# EAGLE design Timer (EAGLE 6.3)
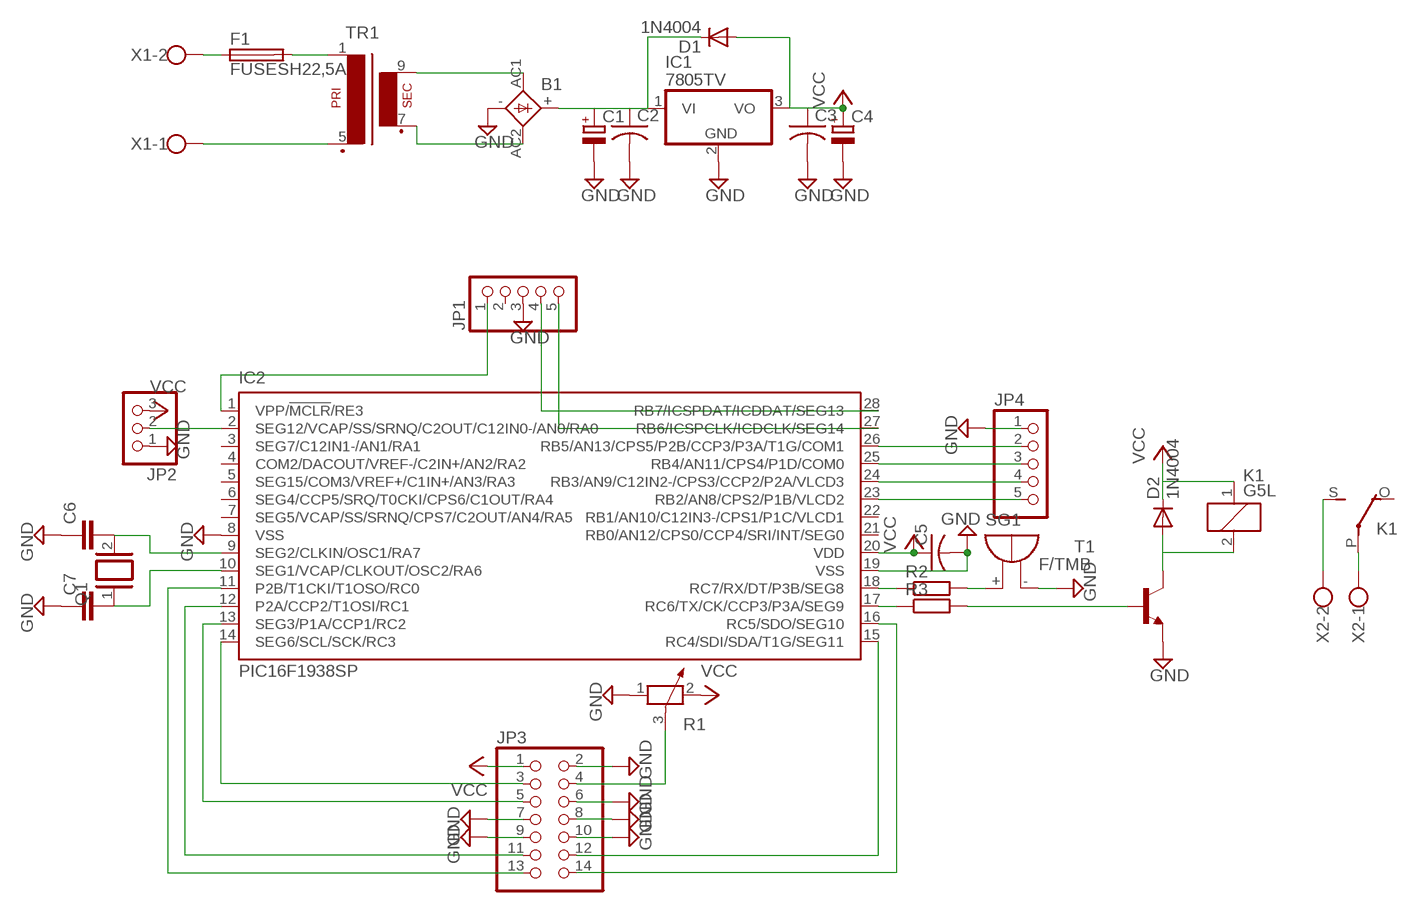
[diagram p0: schematic, sheet 1]

## Parts
B1  1KAB  [1KAB]
C1  CPOL-EUE5-13  [E5-13]
C2  C-US050-030X075  [C050-030X075]
C3  C-US050-030X075  [C050-030X075]
C4  CPOL-EUE3.5-8  [E3,5-8]
C5  C-US050-030X075  [C050-030X075]
C6  C2,5-3  [C2.5-3]
C7  C2,5-3  [C2.5-3]
D1  1N4004  [DO41-10]
D2  1N4004  [DO41-10]
F1  FUSESH22,5A  [SH22,5A]
IC1  7805TV  [TO220V]
IC2  PIC16F1938SP  [DIL28-3]
JP1  PINHD-1X5  [1X05]
JP2  PINHD-1X3  [1X03]
JP3  PINHD-2X7  [2X07]
JP4  PINHD-1X5  [1X05]
K1  G5L  [G5LE]
Q1  XTAL/S  [QS]
R1  POTENTIOMETER_PT-10  [PT-10]
R2  R-EU_0207/10  [0207/10]
R3  R-EU_0207/10  [0207/10]
SG1  F/TMB  [F/TMB]
T1  BC547-NPN-TO92-CBE  [TO92-CBE]
TR1  VV11  [VV11]
X1  W237-102  [W237-102]
X2  W237-102  [W237-102]

## Nets
GND: B1.- C1.- C2.2 C3.2 C4.- C5.2 C6.1 C7.1 IC1.2(GND) IC2.8(VSS) IC2.19(VSS) JP1.3 JP2.1 JP3.2 JP3.6 JP3.7 JP3.8 JP3.9 JP3.10 JP4.1 R1.1 SG1.- T1.E
N$1: JP3.4 R1.3
N$2: F1.1 X1.2
N$3: F1.2 TR1.1
N$4: TR1.5(P2) X1.1
N$5: B1.AC1 TR1.9(S4)
N$6: B1.AC2 TR1.7(S3)
N$7: B1.+ C1.+ C2.1 D1.C IC1.1(VI)
N$8: IC2.1(VPP/!MCLR!/RE3) JP1.1
N$9: IC2.28(RB7/ICSPDAT/ICDDAT/SEG13) JP1.4
N$10: IC2.27(RB6/ICSPCLK/ICDCLK/SEG14) JP1.5
N$11: IC2.2(SEG12/VCAP/SS/SRNQ/C2OUT/C12IN0-/AN0/RA0) JP2.2
N$12: IC2.14(SEG6/SCL/SCK/RC3) JP3.3
N$13: C6.2 IC2.9(SEG2/CLKIN/OSC1/RA7) Q1.2
N$14: C7.2 IC2.10(SEG1/VCAP/CLKOUT/OSC2/RA6) Q1.1
N$15: IC2.13(SEG3/P1A/CCP1/RC2) JP3.5
N$16: IC2.12(P2A/CCP2/T1OSI/RC1) JP3.11
N$17: IC2.11(P2B/T1CKI/T1OSO/RC0) JP3.13
N$18: IC2.15(RC4/SDI/SDA/T1G/SEG11) JP3.12
N$19: IC2.16(RC5/SDO/SEG10) JP3.14
N$20: IC2.26(RB5/AN13/CPS5/P2B/CCP3/P3A/T1G/COM1) JP4.2
N$21: IC2.25(RB4/AN11/CPS4/P1D/COM0) JP4.3
N$22: IC2.24(RB3/AN9/C12IN2-/CPS3/CCP2/P2A/VLCD3) JP4.4
N$23: IC2.23(RB2/AN8/CPS2/P1B/VLCD2) JP4.5
N$24: IC2.18(RC7/RX/DT/P3B/SEG8) R2.1
N$25: R2.2 SG1.+
N$26: IC2.17(RC6/TX/CK/CCP3/P3A/SEG9) R3.1
N$27: R3.2 T1.B
N$28: D2.A K1.2 T1.C
N$29: K1.P(2:P) X2.1
N$30: K1.S(2:S) X2.2
VCC: C3.1 C4.+ C5.1 D1.A D2.C IC1.3(VO) IC2.20(VDD) JP2.3 JP3.1 K1.1 R1.2
Unconnected: IC2.3(SEG7/C12IN1-/AN1/RA1) IC2.4(COM2/DACOUT/VREF-/C2IN+/AN2/RA2) IC2.5(SEG15/COM3/VREF+/C1IN+/AN3/RA3) IC2.6(SEG4/CCP5/SRQ/T0CKI/CPS6/C1OUT/RA4) IC2.7(SEG5/VCAP/SS/SRNQ/CPS7/C2OUT/AN4/RA5) IC2.21(RB0/AN12/CPS0/CCP4/SRI/INT/SEG0) IC2.22(RB1/AN10/C12IN3-/CPS1/P1C/VLCD1) JP1.2 K1.O(2:O)

## Library data of the parts
B1 = rectifier:1KAB: RECTIFIER grid 5,08 x 5,08 mm
C1 = resistor:CPOL-EU: POLARIZED CAPACITOR, European symbol
C2 C3 C5 = rcl:C-US: CAPACITOR, American symbol
C4 = rcl:CPOL-EU: POLARIZED CAPACITOR, European symbol
C6 C7 = capacitor-wima:C: CAPACITOR naming: grid - package width
D1 D2 = diode:1N4004: DIODE general purpose rectifier, 1 A
F1 = fuse:FUSE: Fuse; OC_FARNELL: unknown; OC_NEWARK: unknown
IC1 = linear:78*: Positive VOLTAGE REGULATOR Source: http://cache.national.com/ds/LM/LM78L05.pdf http://www.fairchildsemi.com/ds/LM/LM7805.pdf
IC2 = microchip:PIC16F19*: Flash-Based, 8-Bit CMOS Microcontrollers wtih LCD Driver and nanoWatt XLP Technology Auto generated by make-symbol-device-package-bsdl.ulp Rev. 33 Source: http://ww1.microchip.com/downloads/en/DeviceDoc/41364D.pdf; MPN: PIC16F1938-I/SP; OC_FARNELL: 1755829; OC_NEWARK: 08R1949
JP1 JP4 = pinhead:PINHD-1X5: PIN HEADER
JP2 = pinhead:PINHD-1X3: PIN HEADER
JP3 = pinhead:PINHD-2X7: PIN HEADER
K1 = relay:G5L: RELAY 1 x switch, 10 A/120 V AC, 8 A/30 V ADC, Omron; OC_FARNELL: unknown; OC_NEWARK: unknown
Q1 = special:XTAL/S: CRYSTAL
R1 = rcl:POTENTIOMETER_: Potentiometer
R2 R3 = resistor:R-EU_: RESISTOR, European symbol
SG1 = buzzer:F/TMB: BUZZER Source: Buerklin; OC_FARNELL: unknown; OC_NEWARK: unknown
T1 = transistor:*-NPN-: NPN Transistror BF959 corrected 2008.03.06
TR1 = trafo:VV11: TRANSFORMER 1 primary winding, 1 secondary winding BLOCK
X1 X2 = con-wago-500:W237-102: WAGO SCREW CLAMP; MPN: 237-102; OC_FARNELL: unknown; OC_NEWARK: 70K9898

## Board
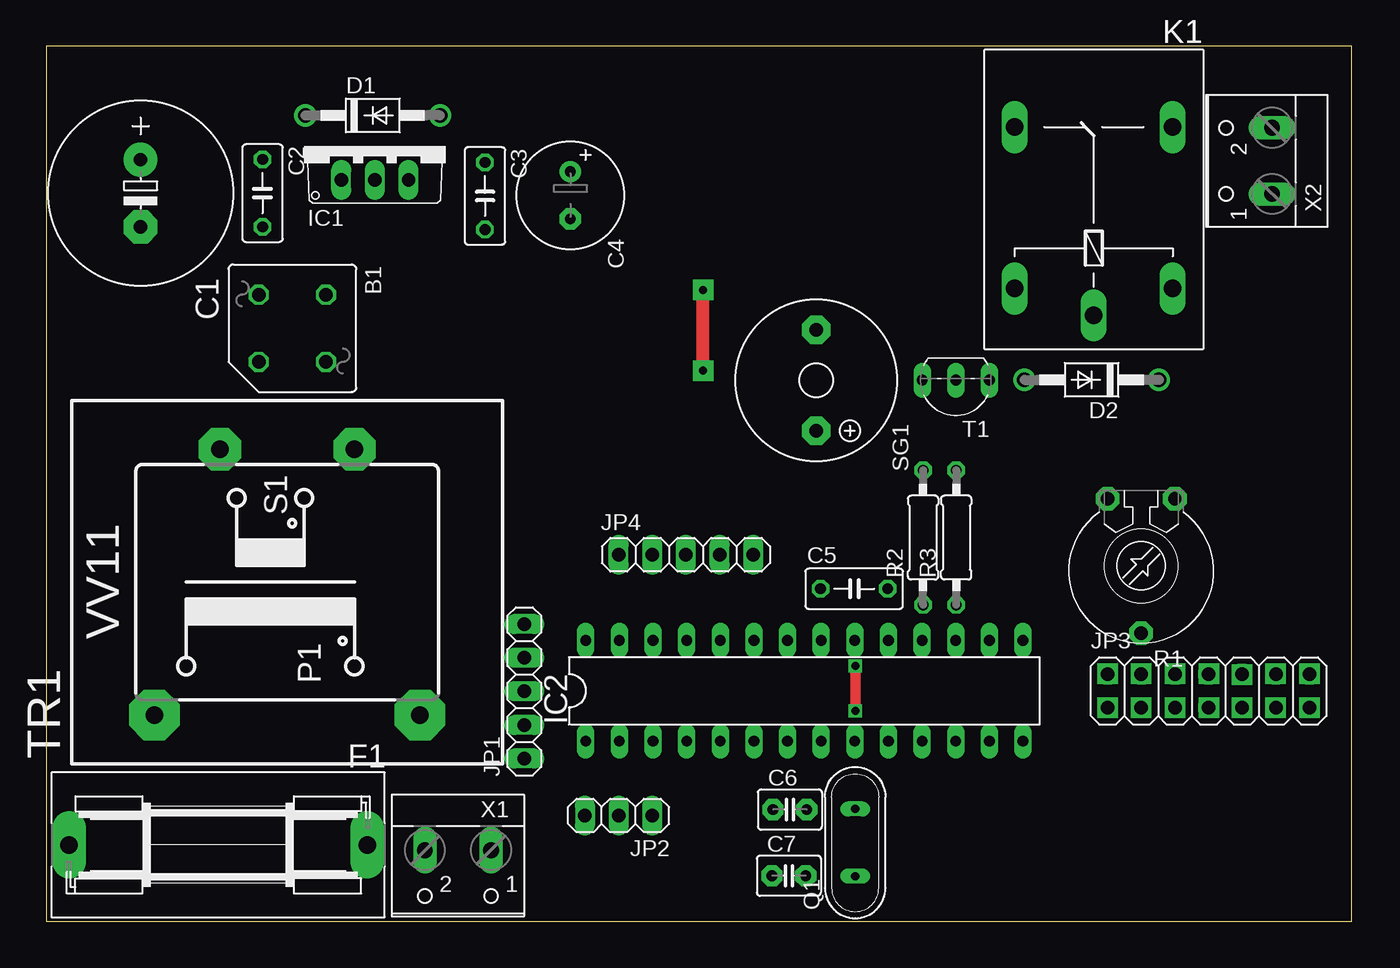
[diagram p1: board, top side]
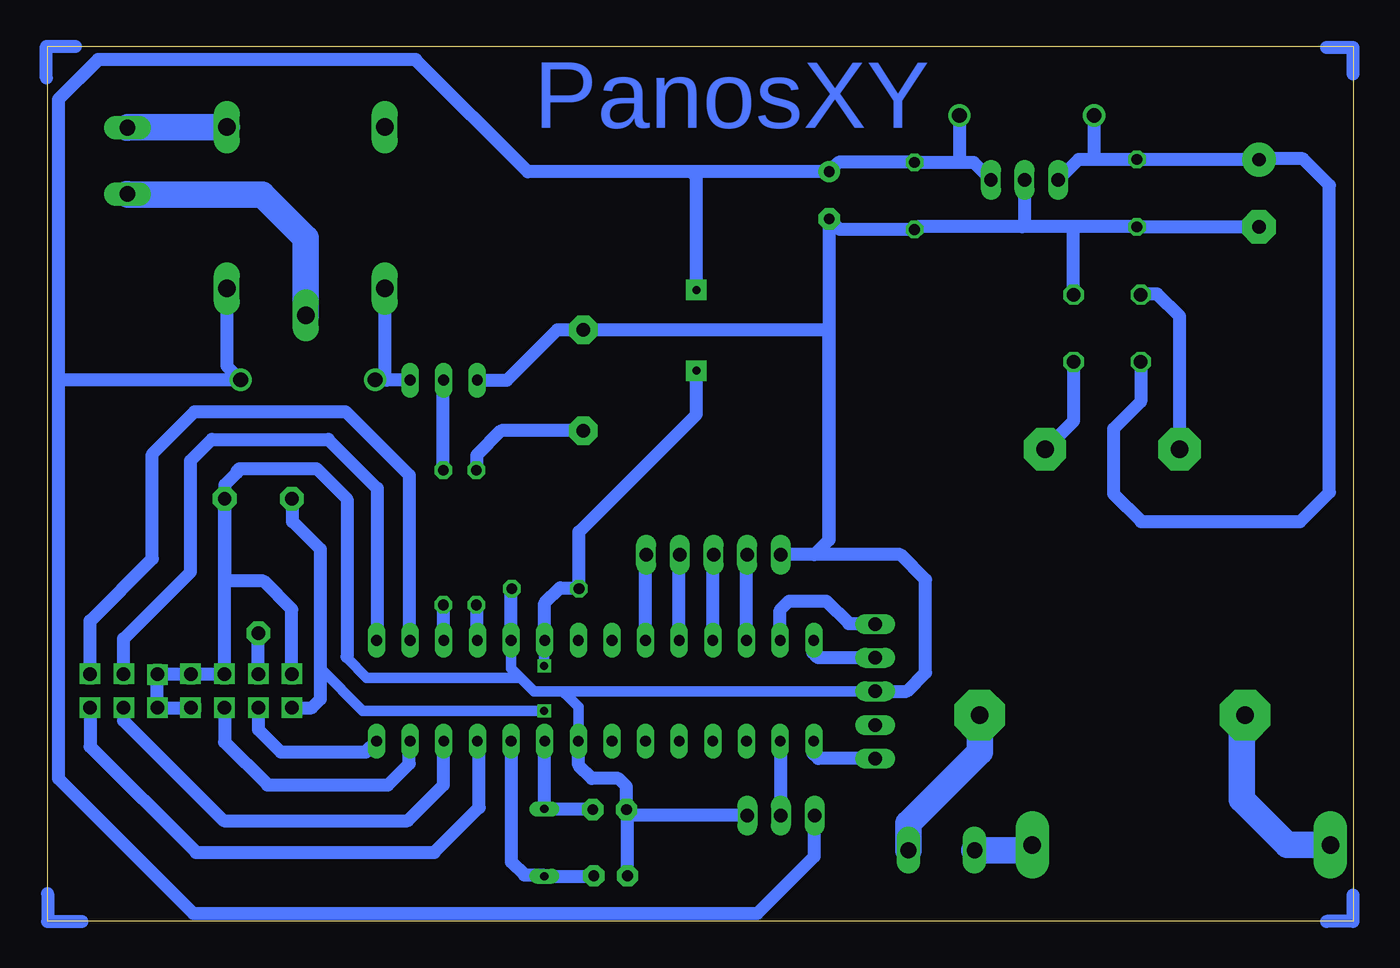
[diagram p2: board, bottom side, seen from below]

Size 98.6 x 66.1 mm. Coordinates in mm from the lower left corner, seen from the top.
Outline: 98.6,0 98.6,66.1 0,66.1 0,0 98.6,0
Copper layers (1*16): Top 0.035mm / dielectric 1.5mm / Bottom 0.035mm
Design rules "default": minimum track width 10mil, minimum drill 24mil, track to track 8mil, track to pad 8mil, pad to pad 8mil, via to via 8mil, smd to smd 8mil, copper to edge 40mil, drill to drill 8mil, minimum pad ring 10mil, minimum via ring 8mil, stop-mask expansion 4mil, vias tented up to drill 0mil, thermal gap 10mil

### Footprints (pad centres in the part's own frame; a part is rotated, then mirrored left to right if it is on the bottom)
1KAB = drill 1.016 octagon: + 2.54,-2.54; - -2.54,2.54; AC1 -2.54,-2.54; AC2 2.54,2.54
E5-13 = drill 1.016 pad 2.54: + -2.54,0 | drill 1.016 pad 2.54 octagon: - 2.54,0
C050-030X075 = drill 0.813 octagon: 1 -2.54,0; 2 2.54,0
E3,5-8 = drill 0.813 pad 1.6: + -1.778,0 | drill 0.813 pad 1.6 octagon: - 1.778,0
C2.5-3 = drill 0.813 pad 1.6 octagon: 1 -1.27,0; 2 1.27,0
DO41-10 = drill 1.118: A 5.08,0; C -5.08,0
SH22,5A = drill 1.321 pad 2.54 long: 1 -11.252,0; 2 11.252,0
TO220V = drill 1.016 long: 1 -2.54,-2.54; 2 0,-2.54; 3 2.54,-2.54
DIL28-3 = drill 0.813 long: 1 -16.51,-3.81; 2 -13.97,-3.81; 3 -11.43,-3.81; 4 -8.89,-3.81; 5 -6.35,-3.81; 6 -3.81,-3.81; 7 -1.27,-3.81; 8 1.27,-3.81; 9 3.81,-3.81; 10 6.35,-3.81; 11 8.89,-3.81; 12 11.43,-3.81; 13 13.97,-3.81; 14 16.51,-3.81; 15 16.51,3.81; 16 13.97,3.81; 17 11.43,3.81; 18 8.89,3.81; 19 6.35,3.81; 20 3.81,3.81; 21 1.27,3.81; 22 -1.27,3.81; 23 -3.81,3.81; 24 -6.35,3.81; 25 -8.89,3.81; 26 -11.43,3.81; 27 -13.97,3.81; 28 -16.51,3.81
1X05 = drill 1.016 long: 1 -5.08,0; 2 -2.54,0; 3 0,0; 4 2.54,0; 5 5.08,0
1X03 = drill 1.016 long: 1 -2.54,0; 2 0,0; 3 2.54,0
2X07 = drill 1.016 octagon: 1 -7.62,-1.27; 2 -7.62,1.27; 3 -5.08,-1.27; 4 -5.08,1.27; 5 -2.54,-1.27; 6 -2.54,1.27; 7 0,-1.27; 8 0,1.27; 9 2.54,-1.27; 10 2.54,1.27; 11 5.08,-1.27; 12 5.08,1.27; 13 7.62,-1.27; 14 7.62,1.27
G5LE = drill 1.321 long: 1 -7.493,-5.969; 2 -7.493,5.969; O 4.699,5.969; P -9.525,0; S 4.699,-5.969
QS = drill 0.61 long: 1 -2.54,0; 2 2.54,0
PT-10 = drill 1.016 pad 1.778 octagon: 1 -2.54,-5.08; 2 2.54,-5.08; 3 0,5.08
0207/10 = drill 0.813 octagon: 1 -5.08,0; 2 5.08,0
F/TMB = drill 1.016 pad 2.159 octagon: + 3.81,0; - -3.81,0
TO92-CBE = drill 0.813 long: B 0,0; C -2.54,0; E 2.54,0
VV11 = drill 1.321 pad 3.81 octagon: 1 -10.033,10.033; 5 -10.033,-10.033 | drill 1.321 pad 3.175 octagon: 7 10.033,-5.08; 9 10.033,5.08
W237-102 = drill 1.194 long: 1 -2.5,-1.27; 2 2.5,-1.27

### Placement (x,y rotation side)
B1  18.58,44.8 270 top
C1  7.12,55 270 top
C2  16.33,55.01 270 top
C3  33.13,54.8 270 top
C4  39.58,54.85 270 top
C5  61.01,25.13 0 top
C6  56.16,8.45 0 top
C7  56.08,3.45 0 top
D1  24.65,60.88 0 top
D2  78.95,40.91 180 top
F1  12.98,5.78 180 top
IC1  24.82,58.56 0 top
IC2  57.25,17.42 0 top
JP1  36.1,17.38 90 top
JP2  43.22,8 180 top
JP3  87.78,17.41 0 top
JP4  48.31,27.7 0 top
K1  79.11,55.3 90 top
Q1  61.09,5.95 90 top
R1  82.69,26.85 180 top
R2  66.22,28.99 90 top
R3  68.72,28.99 90 top
SG1  58.15,40.87 270 top
T1  68.69,40.89 180 top
TR1  18.19,25.63 90 top
X1  31.09,4.11 180 top
X2  91.31,57.45 90 top

### Tracks (layer width: path | path; a pad name or v marks a point on that pad's centre or on a via)
GND
  Bottom 0.8: JP1.3 59.7,17.38 | 59.7,17.38 61.88,17.38 62.95,18.45 | IC2.8 58.52,16.2 59.16,16.84 | 59.16,16.84 59.7,17.38 | 62.95,18.45 63.6,19.1 IC2.19 | 59.16,16.84 59.6,17.3 59.3,17.3 | 76,20 76,19.9 74.5,18.4 63,18.4 62.95,18.45
  Bottom 1: 21.12,52.47 C2.2 C1.- | 21.12,52.47 25,52.47 | 25,52.47 32.92,52.47 C3.2 38.77,52.26 C4.- 39.58,28.82 39.6,28.8 | IC1.2 24.82,52.65 25,52.47 | IC2.19 63.6,25.08 C5.2 | C7.1 54.81,8.37 C6.1 | C6.1 54.89,10.19 55.5,10.8 57.5,10.8 58.5,11.8 58.5,13.59 IC2.8 | JP3.7 JP3.9 JP3.10 JP3.8 JP3.6 85.24,26 | 85.24,26 R1.1 | 84.94,25.7 82.3,25.7 80.16,23.56 JP3.2 | 84.94,25.7 85.24,26 | JP2.1 54.44,8 C6.1 | 84.94,25.7 85.2,25.7 | 85.2,25.6 85.2,25.7 | 85.2,25.7 85.2,33 84.3,33.9 84.3,34 84.1,34.2 78.3,34.2 76,31.9 76,20 | T1.E 63.91,40.89 60.1,44.7 58.17,44.7 SG1.- 39.6,44.68 39.6,28.8 | 39.6,28.8 40.7,27.7 JP4.1 34.2,27.7 32.3,25.8 32.3,18.8 33.72,17.38 JP1.3 | B1.- 21.12,52.47
N$1  (via drill 0.6 pad 1.55)
  Bottom 1: JP3.4 v82.7,18.7 R1.3
N$2
  Bottom 2: X1.2 24.63,5.38 F1.1
N$3
  Bottom 2: F1.2 4.98,5.78 8.4,9.2 8.4,15.35 TR1.1
N$4
  Bottom 2: X1.1 33.59,7.41 28.2,12.8 28.2,15.57 TR1.5
N$5
  Bottom 1: TR1.9 13.11,45.71 14.8,47.4 15.98,47.4 B1.AC1
N$6
  Bottom 1: B1.AC2 21.12,37.81 TR1.7
N$7
  Bottom 1: B1.+ 16.04,39.26 18.1,37.2 18.1,32.3 16,30.2 4,30.2 1.8,32.4 1.8,55.6 3.8,57.6 7.06,57.6 C1.+ C2.1 19.5,57.55 | 19.5,57.55 20.75,57.55 IC1.1 | D1.C 19.57,57.62 19.5,57.55
N$8
  Bottom 1: JP1.1 40.4,12.3 40.8,12.7 40.8,13.55 IC2.1
N$9
  Bottom 1: JP1.4 40.42,19.92 40.8,20.3 40.8,21.17 IC2.28
N$10
  Bottom 1: IC2.27 43.28,23.52 42.6,24.2 39.8,24.2 38.1,22.5 36.14,22.5 JP1.5
N$11
  Bottom 1: JP2.2 43.22,13.55 IC2.2
N$12
  Bottom 1: JP3.3 82.7,14.5 81,12.8 74.57,12.8 IC2.14
N$13
  Bottom 1: IC2.9 61.09,13.58 Q1.2 57.47,8.49 C6.2
N$14
  Bottom 1: IC2.10 63.6,4.5 62.6,3.5 61.18,3.5 Q1.1 57.39,3.41 C7.2
N$15
  Bottom 1: JP3.5 85.24,13.54 82,10.3 72.9,10.3 71.3,11.9 71.3,13.53 IC2.13
N$16
  Bottom 1: JP3.11 92.86,15.16 85.3,7.6 71.4,7.6 68.7,10.3 68.7,13.59 IC2.12
N$17
  Bottom 1: JP3.13 95.4,13.2 87.4,5.2 69.4,5.2 66,8.6 66,13.47 IC2.11
N$18
  Bottom 1: JP3.12 92.86,21.34 87.8,26.4 87.8,34.8 86.2,36.4 77.4,36.4 73.7,32.7 73.7,21.29 IC2.15 73.8,21.27
N$19  (via drill 0.6 pad 1.55)
  Bottom 1: JP3.14 v95.4,18.7 95.4,22.7 90.7,27.4 90.7,35.3 87.5,38.5 76.1,38.5 71.3,33.7 71.3,21.31 IC2.16
N$20
  Bottom 1: IC2.26 45.82,27.65 JP4.2
N$21
  Bottom 1: IC2.25 48.36,27.65 JP4.3
N$22
  Bottom 1: IC2.24 50.9,27.65 JP4.4
N$23
  Bottom 1: IC2.23 53.44,27.65 JP4.5
N$24
  Bottom 1: R2.1 66.22,21.31 IC2.18
N$25
  Bottom 1: SG1.+ 64.34,37.06 66.2,35.2 66.2,34.09 R2.2
N$26
  Bottom 1: R3.1 68.72,21.27 IC2.17
N$27
  Bottom 1: R3.2 68.72,41.26 T1.B
N$28
  Bottom 1: T1.C 73,40.89 | 73,40.89 73.85,40.89 D2.A | K1.2 73.14,41.03 73,40.89
N$29
  Bottom 2: K1.P 79.11,51.61 82.4,54.9 92.53,54.9 X2.1
N$30
  Bottom 2: K1.S 92.53,60 X2.2
N$31
  Bottom 1: 0,64 0,66 2,66
N$32
  Bottom 1: 2,0 0,0 0,2
N$33
  Bottom 1: 98.6,2.1 98.6,0 96,0
N$34
  Bottom 1: 98.7,63.7 98.7,66.1 96.5,66.1
N$35  (via drill 0.6 pad 1.55)
  other vias: 80.15,16.15
N$36  (via drill 0.6 pad 1.55)
  other vias: 80.15,18.7
N$37  (via drill 0.6 pad 1.55)
  other vias: 82.7,16.15
N$38  (via drill 0.6 pad 1.55)
  other vias: 85.25,16.15
N$39  (via drill 0.6 pad 1.55)
  other vias: 85.25,18.7
N$40  (via drill 0.6 pad 1.55)
  other vias: 87.8,16.15
N$41  (via drill 0.6 pad 1.55)
  other vias: 87.8,18.7
N$42  (via drill 0.6 pad 1.55)
  other vias: 90.3,16.15
N$43  (via drill 0.6 pad 1.55)
  other vias: 90.3,18.65
N$44  (via drill 0.6 pad 1.55)
  other vias: 92.85,16.15
N$45  (via drill 0.6 pad 1.55)
  other vias: 92.85,18.7
N$46  (via drill 0.6 pad 1.55)
  other vias: 95.4,16.15
VCC  (via drill 0.6, 0.6 pad 1.55)
  Top 0.8: v61.1,15.9 v61.1,19.3
  Top 1: v49.6,41.6 v49.6,47.7
  Bottom 0.8: 78,28.1 78,19.1 74.8,15.9 v61.1,15.9 | v61.1,19.3 61.1,21.19 IC2.20 | D2.C 97.69,40.91 97.7,40.9 97.7,62.3 95,65 70.8,65 62.4,56.6 51.6,56.6
  Bottom 1: 30,57.34 C3.1 38.87,57.34 C4.+ 50,56.63 | 30,57.34 28.68,57.34 IC1.3 | D1.A 29.73,57.61 30,57.34 | IC2.20 61.06,24.04 59.9,25.2 58.54,25.2 C5.1 58.47,29.43 49.6,38.3 v49.6,41.6 | 80.08,32 R1.2 80.1,31.88 80.1,30.2 78,28.1 78,16.8 78.66,16.14 JP3.1 | K1.1 85.08,41.96 D2.C 97.71,40.91 97.8,41 | 50,56.63 62.33,56.63 70.8,65.1 94.8,65.1 97.8,62.1 97.8,41 | 97.8,41 97.8,10.8 87.6,0.6 45,0.6 40.7,4.9 40.7,7.98 JP2.3 | v49.6,47.7 49.6,56.23 50,56.63

### Text on the board
Bottom: PanosXY